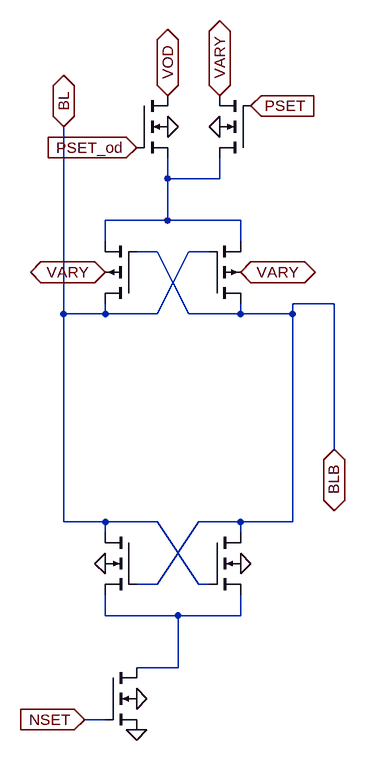
[diagram p0: schematic sense_amplifier.asc]
sense_amplifier.asc, the LTspice schematic file:
Version 4
SHEET 1 15896 2520
WIRE 928 -720 928 -752
WIRE 1008 -720 1008 -752
WIRE 1008 -720 928 -720
WIRE 928 -656 928 -720
WIRE 928 -656 832 -656
WIRE 1040 -656 928 -656
WIRE 832 -624 832 -656
WIRE 1040 -624 1040 -656
WIRE 912 -608 880 -608
WIRE 992 -608 960 -608
WIRE 1184 -528 1120 -528
WIRE 768 -512 768 -800
WIRE 832 -512 832 -528
WIRE 832 -512 768 -512
WIRE 912 -512 960 -608
WIRE 912 -512 832 -512
WIRE 960 -512 912 -608
WIRE 1040 -512 1040 -528
WIRE 1040 -512 960 -512
WIRE 1120 -512 1120 -528
WIRE 1120 -512 1040 -512
WIRE 1184 -304 1184 -528
WIRE 768 -192 768 -512
WIRE 832 -192 768 -192
WIRE 912 -192 832 -192
WIRE 1040 -192 976 -192
WIRE 1120 -192 1120 -512
WIRE 1120 -192 1040 -192
WIRE 832 -176 832 -192
WIRE 1040 -176 1040 -192
WIRE 912 -96 976 -192
WIRE 912 -96 880 -96
WIRE 976 -96 912 -192
WIRE 992 -96 976 -96
WIRE 832 -48 832 -80
WIRE 944 -48 832 -48
WIRE 1040 -48 1040 -80
WIRE 1040 -48 944 -48
WIRE 944 32 944 -48
WIRE 944 32 880 32
WIRE 832 112 800 112
FLAG 800 112 NSET
IOPIN 800 112 In
FLAG 880 128 0
FLAG 1040 -576 VARY
IOPIN 1040 -576 BiDir
FLAG 832 -576 VARY
IOPIN 832 -576 BiDir
FLAG 928 -848 VOD
IOPIN 928 -848 BiDir
FLAG 1184 -304 BLB
IOPIN 1184 -304 BiDir
FLAG 768 -800 BL
IOPIN 768 -800 BiDir
FLAG 832 -128 0
FLAG 1040 -128 0
FLAG 880 80 0
FLAG 928 -800 0
FLAG 1008 -800 0
FLAG 1008 -848 VARY
IOPIN 1008 -848 BiDir
FLAG 880 -768 PSET_od
IOPIN 880 -768 In
FLAG 1056 -832 PSET
IOPIN 1056 -832 In
SYMBOL nmos4 832 32 R0
WINDOW 0 104 24 Invisible 2
WINDOW 3 179 41 Invisible 2
SYMATTR InstName M1
SYMATTR Value2 l={mc({SA_nset_L_}, mc_variation)} w={mc({SA_nset_W_}, mc_variation)}
SYMBOL nmos4 992 -176 R0
WINDOW 0 104 24 Invisible 2
WINDOW 3 179 41 Invisible 2
SYMATTR InstName M2
SYMATTR Value2 l={mc({SA_nmos_L_},mc_variation)} w={mc({SA_nmos_W_}, mc_variation)}
SYMBOL nmos4 880 -176 M0
WINDOW 0 104 24 Invisible 2
WINDOW 3 179 41 Invisible 2
SYMATTR InstName M3
SYMATTR Value2 l={mc({SA_nmos_L_},mc_variation)} w={mc({SA_nmos_W_},mc_variation)}
SYMBOL pmos4 992 -528 M180
WINDOW 0 56 32 Invisible 2
WINDOW 3 56 72 Invisible 2
SYMATTR InstName M10
SYMATTR Value2 l={mc({SA_pmos_L_}, mc_variation)} w={mc({SA_pmos_W_},mc_variation)}
SYMBOL pmos4 880 -528 R180
WINDOW 0 56 32 Invisible 2
WINDOW 3 56 72 Invisible 2
SYMATTR InstName M11
SYMATTR Value2 l={mc({SA_pmos_L_}, mc_variation)} w={mc({SA_pmos_W_}, mc_variation)}
SYMBOL nmos4 880 -848 R0
WINDOW 0 104 24 Invisible 2
WINDOW 3 179 41 Invisible 2
SYMATTR InstName M4
SYMATTR Value2 l={mc({SA_pset_Lod_}, mc_variation)} w={mc({SA_pset_Wod_}, mc_variation)}
SYMBOL nmos4 1056 -752 R180
WINDOW 0 104 24 Invisible 2
WINDOW 3 179 41 Invisible 2
SYMATTR InstName M5
SYMATTR Value2 l={mc({SA_pset_L_}, mc_variation)} w={mc({SA_pset_W_}, mc_variation)}

The netlist it stands for:
* sense_amplifier.asc
M1 N002 NSET 0 0 NMOS l={mc({SA_nset_L_}, mc_variation)} w={mc({SA_nset_W_}, mc_variation)}
M2 BLB BL N002 0 NMOS l={mc({SA_nmos_L_},mc_variation)} w={mc({SA_nmos_W_}, mc_variation)}
M3 BL BLB N002 0 NMOS l={mc({SA_nmos_L_},mc_variation)} w={mc({SA_nmos_W_},mc_variation)}
M10 BLB BL N001 VARY PMOS l={mc({SA_pmos_L_}, mc_variation)} w={mc({SA_pmos_W_},mc_variation)}
M11 BL BLB N001 VARY PMOS l={mc({SA_pmos_L_}, mc_variation)} w={mc({SA_pmos_W_}, mc_variation)}
M4 VOD PSET_od N001 0 NMOS l={mc({SA_pset_Lod_}, mc_variation)} w={mc({SA_pset_Wod_}, mc_variation)}
M5 N001 PSET VARY 0 NMOS l={mc({SA_pset_L_}, mc_variation)} w={mc({SA_pset_W_}, mc_variation)}
.model NMOS NMOS
.model PMOS PMOS
.lib standard.mos
.backanno
.end